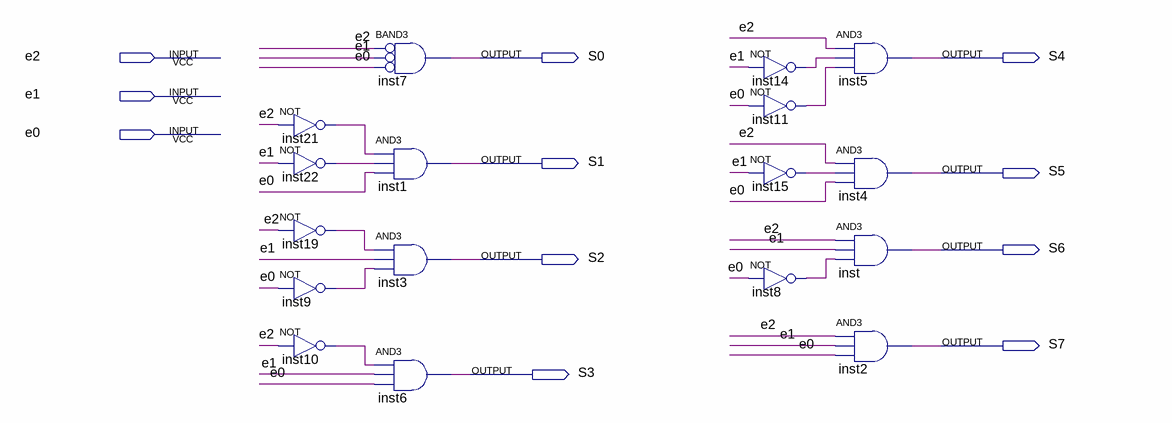
[diagram p0: schematic sheet]
// Quartus schematic decod_3x8.bdf as structural Verilog: 17 symbols, 11 pins
module decod_3x8 (
  input  e2,
  input  e1,
  input  e0,
  output S0,
  output S4,
  output S1,
  output S5,
  output S6,
  output S2,
  output S7,
  output S3
);

  wire inst8_out, inst9_out, inst10_out, inst11_out, inst14_out, inst15_out, inst19_out, inst21_out,
       inst22_out;

  not inst21 (inst21_out, e2);
  not inst22 (inst22_out, e1);
  not inst19 (inst19_out, e2);
  not inst9 (inst9_out, e0);
  not inst10 (inst10_out, e2);
  and inst7 (S0, ~e2, ~e1, ~e0);  // BAND3
  and inst1 (S1, inst21_out, inst22_out, e0);
  and inst3 (S2, inst19_out, e1, inst9_out);
  and inst6 (S3, inst10_out, e1, e0);
  not inst14 (inst14_out, e1);
  not inst11 (inst11_out, e0);
  not inst15 (inst15_out, e1);
  not inst8 (inst8_out, e0);
  and inst5 (S4, e2, inst14_out, inst11_out);
  and inst4 (S5, e2, inst15_out, e0);
  and inst (S6, e2, e1, inst8_out);
  and inst2 (S7, e2, e1, e0);
endmodule
